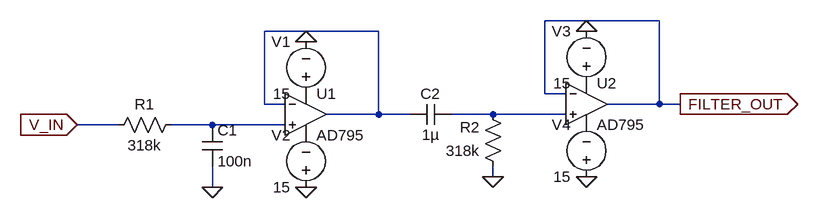
[diagram p0: schematic FO_BPF.asc]
FO_BPF.asc, the LTspice schematic file:
Version 4.1
SHEET 1 972 680
WIRE 736 16 560 16
WIRE 304 32 128 32
WIRE 560 128 560 16
WIRE 592 128 560 128
WIRE 128 144 128 32
WIRE 160 144 128 144
WIRE 736 144 736 16
WIRE 736 144 656 144
WIRE 768 144 736 144
WIRE 304 160 304 32
WIRE 304 160 224 160
WIRE 352 160 304 160
WIRE 480 160 416 160
WIRE 592 160 480 160
WIRE -96 176 -160 176
WIRE 48 176 -16 176
WIRE 160 176 48 176
WIRE 480 256 480 240
WIRE 48 272 48 240
FLAG 48 272 0
FLAG -160 176 V_IN
IOPIN -160 176 In
FLAG 192 48 0
FLAG 192 272 0
FLAG 480 256 0
FLAG 624 32 0
FLAG 624 256 0
FLAG 768 144 FILTER_OUT
IOPIN 768 144 Out
SYMBOL OpAmps\\AD795 192 96 R0
SYMATTR InstName U1
SYMBOL cap 32 176 R0
SYMATTR InstName C1
SYMATTR Value 100n
SYMBOL res 0 160 R90
WINDOW 0 0 56 VBottom 2
WINDOW 3 32 56 VTop 2
SYMATTR InstName R1
SYMATTR Value 318k
SYMBOL voltage 192 144 R180
WINDOW 0 24 96 Left 2
WINDOW 3 24 16 Left 2
WINDOW 123 0 0 Left 0
WINDOW 39 0 0 Left 0
SYMATTR InstName V1
SYMATTR Value 15
SYMBOL voltage 192 288 R180
WINDOW 0 24 96 Left 2
WINDOW 3 24 16 Left 2
WINDOW 123 0 0 Left 0
WINDOW 39 0 0 Left 0
SYMATTR InstName V2
SYMATTR Value 15
SYMBOL OpAmps\\AD795 624 80 R0
SYMATTR InstName U2
SYMBOL voltage 624 128 R180
WINDOW 0 24 96 Left 2
WINDOW 3 24 16 Left 2
WINDOW 123 0 0 Left 0
WINDOW 39 0 0 Left 0
SYMATTR InstName V3
SYMATTR Value 15
SYMBOL voltage 624 272 R180
WINDOW 0 24 96 Left 2
WINDOW 3 24 16 Left 2
WINDOW 123 0 0 Left 0
WINDOW 39 0 0 Left 0
SYMATTR InstName V4
SYMATTR Value 15
SYMBOL res 496 256 R180
WINDOW 0 36 76 Left 2
WINDOW 3 36 40 Left 2
SYMATTR InstName R2
SYMATTR Value 318k
SYMBOL cap 416 144 R90
WINDOW 0 0 32 VBottom 2
WINDOW 3 32 32 VTop 2
SYMATTR InstName C2
SYMATTR Value 1µ

The netlist it stands for:
* FO_BPF.asc
X§U1 N003 N001 P001 P002 N001 AD795  ; pins In+ In- V+ V- OUT
C1 N003 0 100n
R1 N003 V_IN 318k
V1 P001 0 15
V2 0 P002 15
X§U2 N002 FILTER_OUT P003 P004 FILTER_OUT AD795  ; pins In+ In- V+ V- OUT
V3 P003 0 15
V4 0 P004 15
R2 0 N002 318k
C2 N002 N001 1µ
.lib ADI1.lib
.backanno
.end